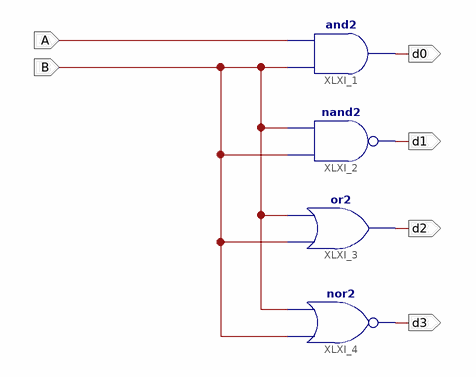
[diagram p0: schematic sheet 1]
// Xilinx ISE schematic lab1.sch (spartan3e) as structural Verilog: 4 symbols, 6 ports
module lab1 (
  input  A,
  input  B,
  output d1,
  output d0,
  output d2,
  output d3
);

  and XLXI_1 (d0, B, A);
  nand XLXI_2 (d1, B, B);
  or XLXI_3 (d2, B, B);
  nor XLXI_4 (d3, B, B);
endmodule
